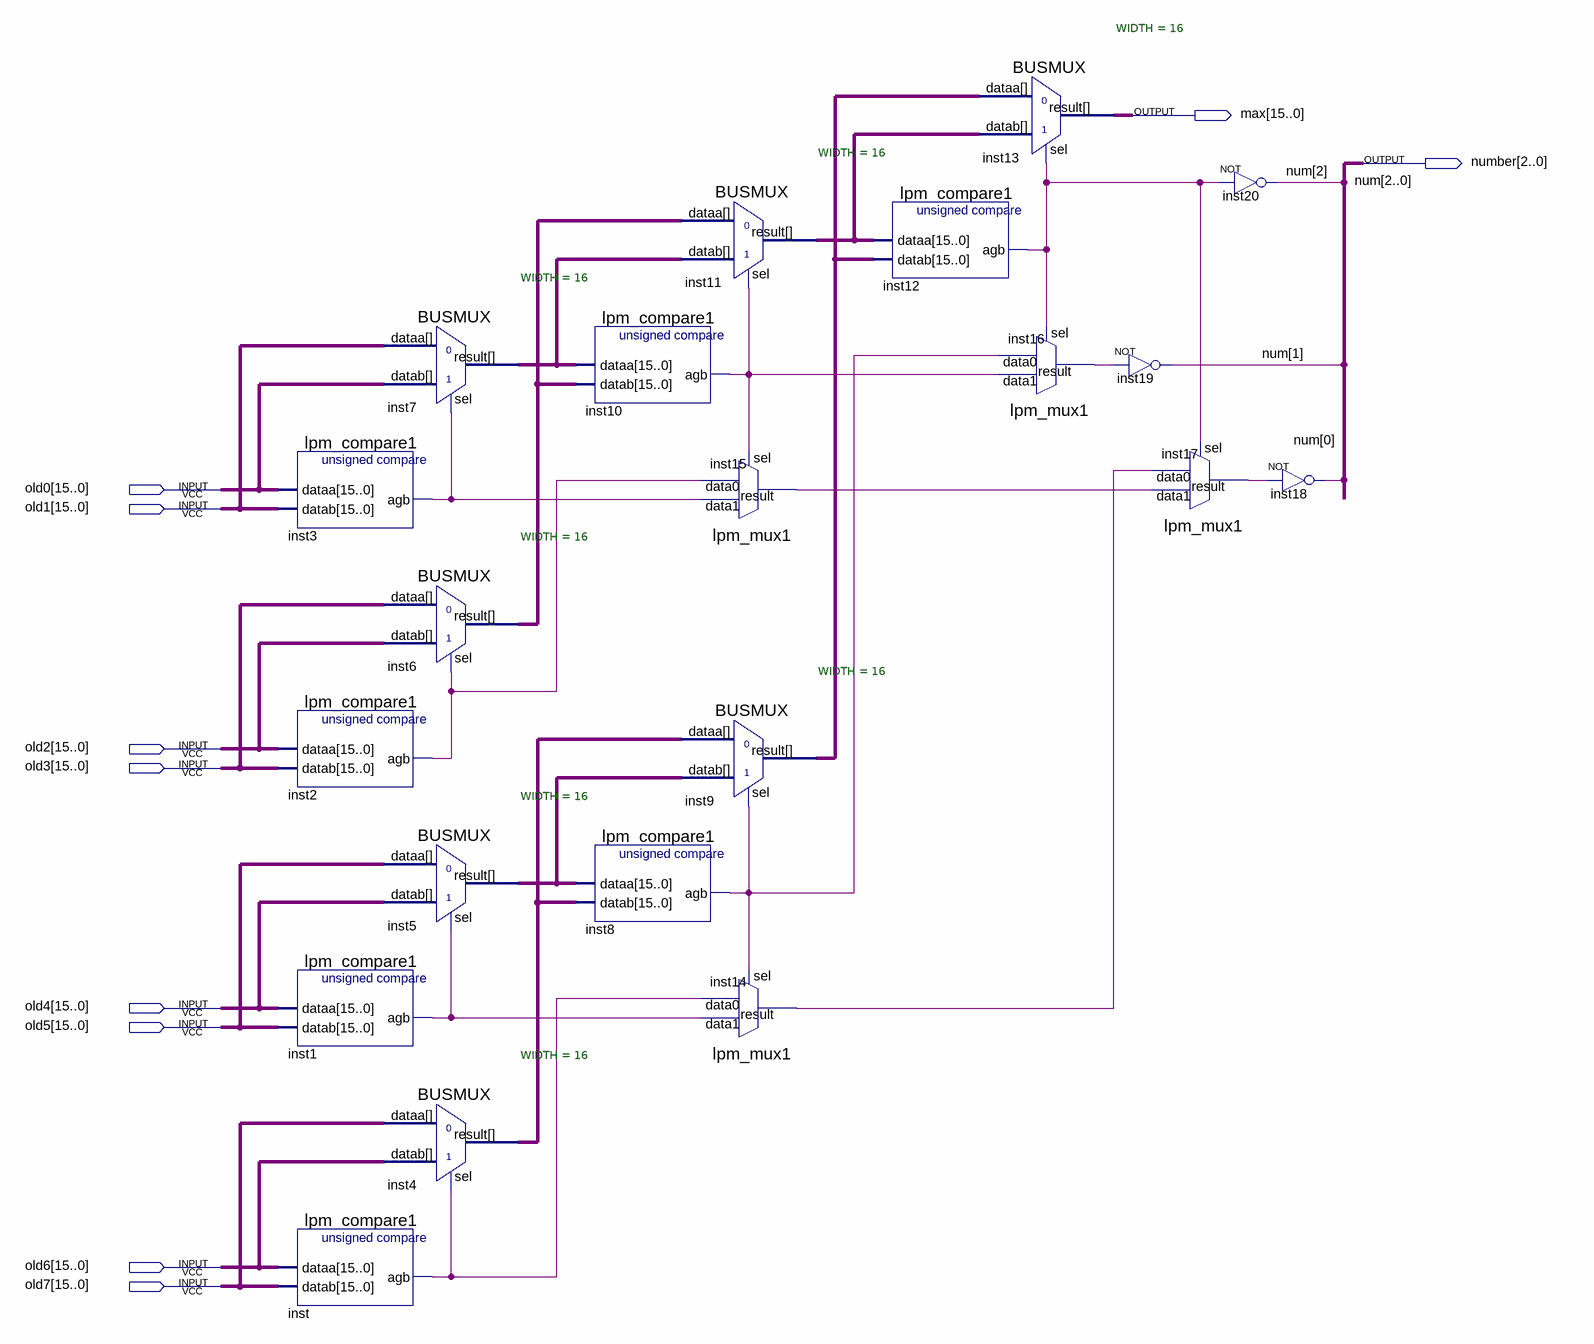
[diagram p0: schematic sheet]
// Quartus schematic Comparator.bdf as structural Verilog: 21 symbols, 10 pins
module Comparator (
  input  [15:0] old0,
  input  [15:0] old1,
  input  [15:0] old2,
  input  [15:0] old3,
  input  [15:0] old4,
  input  [15:0] old5,
  input  [15:0] old6,
  input  [15:0] old7,
  output [15:0] max,
  output [2:0] number
);

  wire inst1_agb, inst2_agb, inst3_agb, inst8_agb, inst10_agb, inst12_agb, inst14_result, inst15_result,
       inst16_result, inst17_result, inst_agb;
  wire [15:0] inst4_result, inst5_result, inst6_result, inst7_result, inst9_result, inst11_result;

  lpm_compare1 inst3 (.dataa(old0), .datab(old1), .agb(inst3_agb));
  lpm_compare1 inst2 (.dataa(old2), .datab(old3), .agb(inst2_agb));
  lpm_compare1 inst1 (.dataa(old4), .datab(old5), .agb(inst1_agb));
  lpm_compare1 inst (.dataa(old6), .datab(old7), .agb(inst_agb));
  BUSMUX #(.WIDTH(16)) inst7 (.datab(old0), .sel(inst3_agb), .dataa(old1), .result(inst7_result));
  BUSMUX #(.WIDTH(16)) inst6 (.datab(old2), .sel(inst2_agb), .dataa(old3), .result(inst6_result));
  BUSMUX #(.WIDTH(16)) inst5 (.datab(old4), .sel(inst1_agb), .dataa(old5), .result(inst5_result));
  BUSMUX #(.WIDTH(16)) inst4 (.datab(old6), .sel(inst_agb), .dataa(old7), .result(inst4_result));
  lpm_compare1 inst10 (.dataa(inst7_result), .datab(inst6_result), .agb(inst10_agb));
  lpm_compare1 inst8 (.dataa(inst5_result), .datab(inst4_result), .agb(inst8_agb));
  BUSMUX #(.WIDTH(16)) inst11 (.datab(inst7_result), .sel(inst10_agb), .dataa(inst6_result), .result(inst11_result));
  lpm_mux1 inst15 (.data1(inst3_agb), .data0(inst2_agb), .sel(inst10_agb), .result(inst15_result));
  BUSMUX #(.WIDTH(16)) inst9 (.datab(inst5_result), .sel(inst8_agb), .dataa(inst4_result), .result(inst9_result));
  lpm_mux1 inst14 (.data1(inst1_agb), .data0(inst_agb), .sel(inst8_agb), .result(inst14_result));
  lpm_compare1 inst12 (.dataa(inst11_result), .datab(inst9_result), .agb(inst12_agb));
  BUSMUX #(.WIDTH(16)) inst13 (.datab(inst11_result), .sel(inst12_agb), .dataa(inst9_result), .result(max));
  lpm_mux1 inst16 (.data1(inst10_agb), .data0(inst8_agb), .sel(inst12_agb), .result(inst16_result));
  not inst19 (number[1], inst16_result);
  lpm_mux1 inst17 (.data1(inst15_result), .data0(inst14_result), .sel(inst12_agb), .result(inst17_result));
  not inst20 (number[2], inst12_agb);
  not inst18 (number[0], inst17_result);

  // Other names for the same wires on the sheet: num[2:0] = number
endmodule
